# EAGLE design Env_sensor_v1.0 (EAGLE 9.3.0)

## Sheet 1 of 2
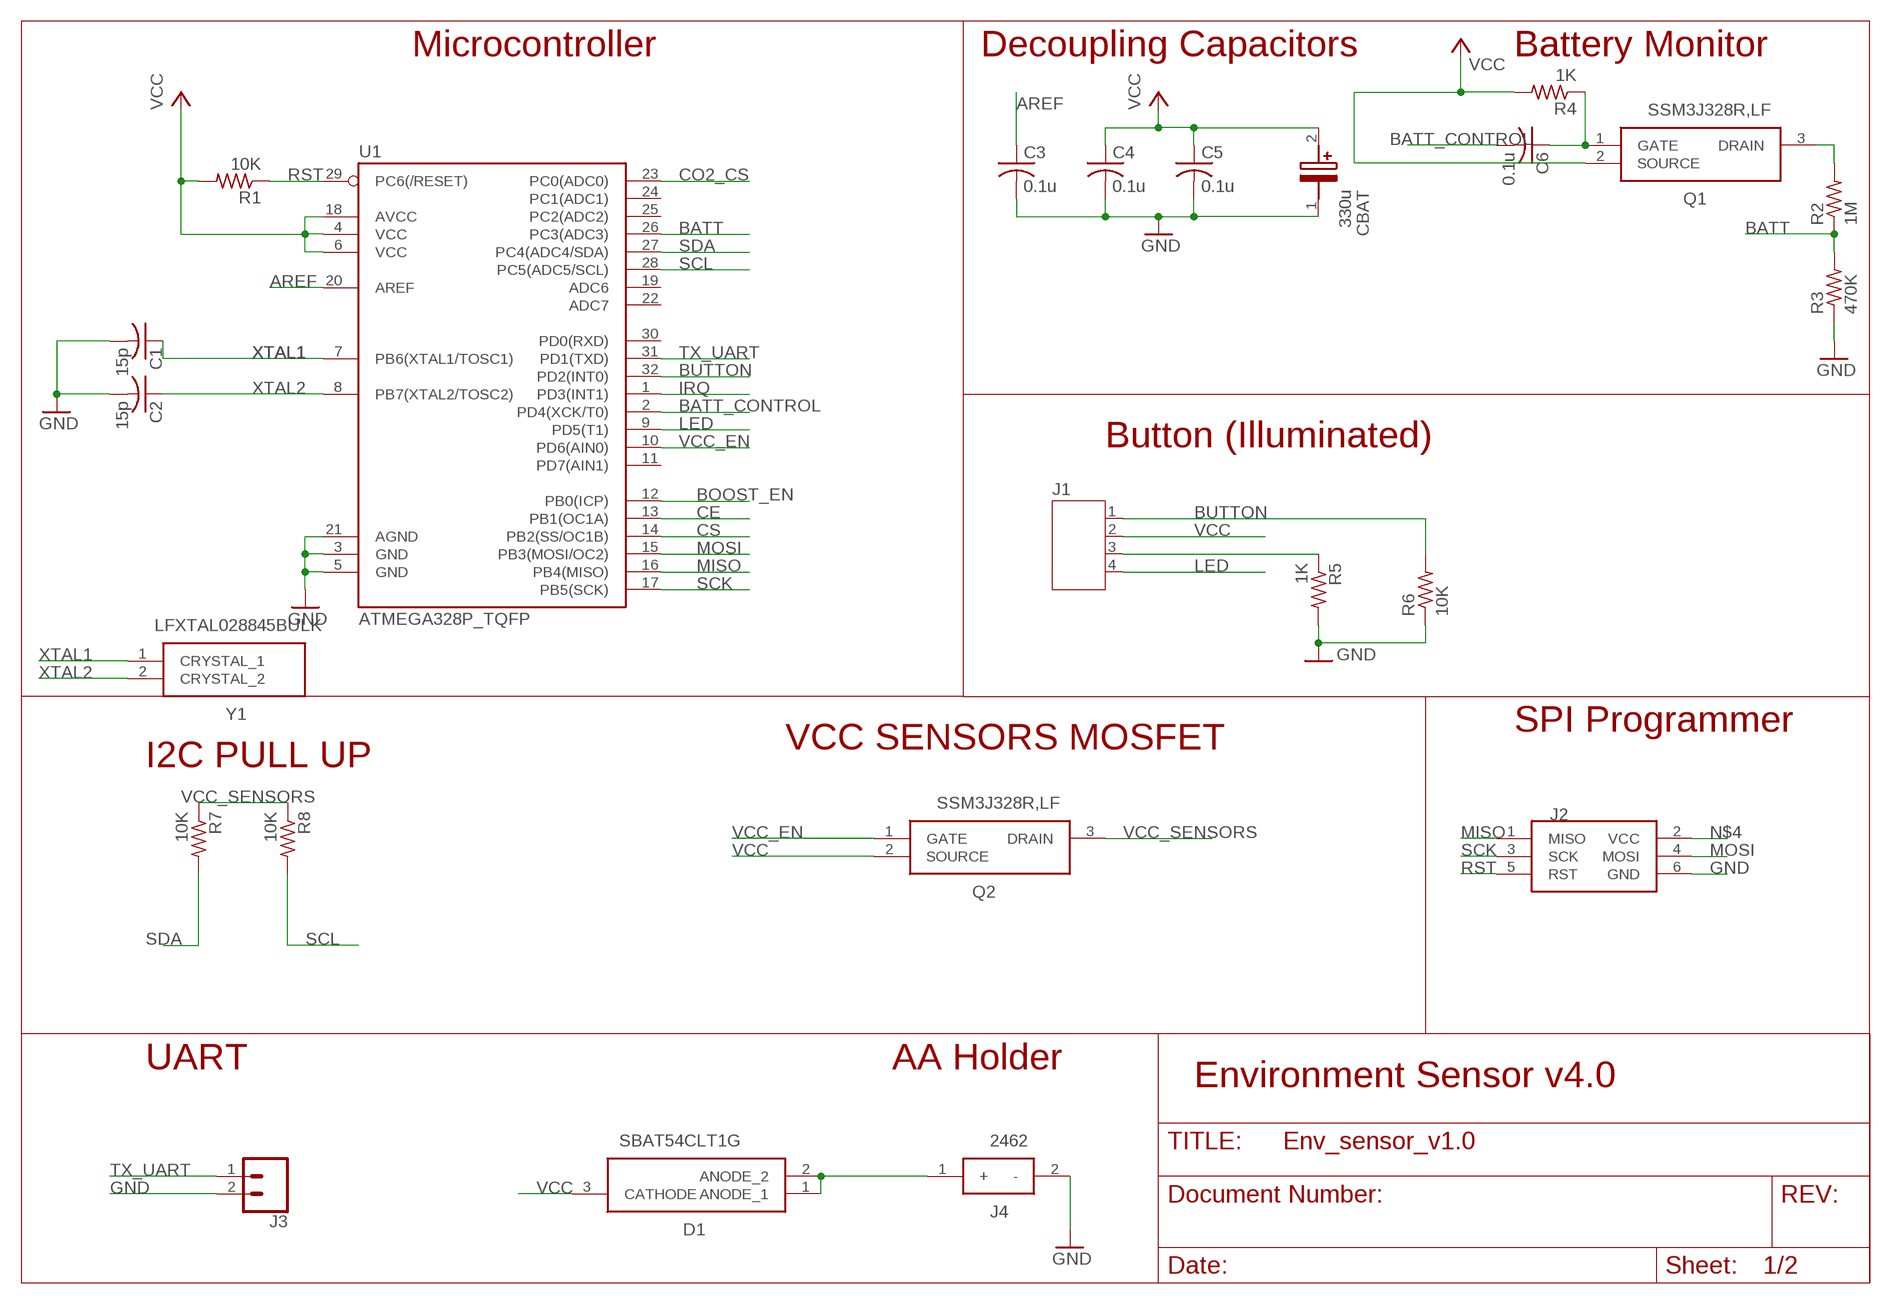
[diagram p0: schematic, sheet 1]

### Parts
C1  15p  CAPACITOR-SMD-0805  [SMD-0805]
C2  15p  CAPACITOR-SMD-0805  [SMD-0805]
C3  0.1u  CAPACITOR-SMD-0805  [SMD-0805]
C4  0.1u  CAPACITOR-SMD-0805  [SMD-0805]
C5  0.1u  CAPACITOR-SMD-0805  [SMD-0805]
C6  0.1u  CAPACITOR-SMD-0805  [SMD-0805]
CBAT  330u  EEE-FNC271XUP  [SMD_LYTIC_D8]
D1  SBAT54CLT1G  [SOT96P237X111-3N]
J1  JST-PH4  [JST-PH4]
J2  ISP  AVRISP-6  [AVRISP]
J3  CONN_02  [1X02]
J4  2462  [2462]
Q1  SSM3J328R,LF  [SOTFL95P240X88-3N]
Q2  SSM3J328R,LF  [SOTFL95P240X88-3N]
R1  10K  RESISTOR-SMD-0805  [SMD-0805]
R2  1M  RESISTOR-SMD-0805  [SMD-0805]
R3  470K  RESISTOR-SMD-0805  [SMD-0805]
R4  1K  RESISTOR-SMD-0805  [SMD-0805]
R5  1K  RESISTOR-SMD-0805  [SMD-0805]
R6  10K  RESISTOR-SMD-0805  [SMD-0805]
R7  10K  RESISTOR-SMD-0805  [SMD-0805]
R8  10K  RESISTOR-SMD-0805  [SMD-0805]
U1  ATMEGA328P_TQFP  [TQFP32-08]
Y1  LFXTAL028845BULK  [LFXTAL028845BULK]

### Nets
AREF: C3.1 U1.20(AREF)
BATT: R2.1 R3.2 U1.26(PC3(ADC3))
BATT_CONTROL: C6.2 U1.2(PD4(XCK/T0))
BOOST_EN: U1.12(PB0(ICP)) ; also sheet 2
BUTTON: J1.1 R6.2 U1.32(PD2(INT0))
CE: U1.13(PB1(OC1A)) ; also sheet 2
CO2_CS: U1.23(PC0(ADC0)) ; also sheet 2
CS: U1.14(PB2(SS/OC1B)) ; also sheet 2
GND: C1.2 C2.2 C3.2 C4.2 C5.2 CBAT.1 J2.6(GND) J3.2 J4.2(-) R3.1 R5.2 R6.1 U1.3(GND) U1.5(GND) U1.21(AGND) ; also sheet 2
IRQ: U1.1(PD3(INT1)) ; also sheet 2
LED: J1.4 U1.9(PD5(T1))
MISO: J2.1(MISO) U1.16(PB4(MISO)) ; also sheet 2
MOSI: J2.4(MOSI) U1.15(PB3(MOSI/OC2)) ; also sheet 2
N$2: Q1.3(DRAIN) R2.2
N$3: D1.1(ANODE_1) D1.2(ANODE_2) J4.1(+)
N$4: J2.2(VCC)
N$7: J1.3 R5.1
N$8: C6.1 Q1.1(GATE) R4.1
RST: J2.5(RST) R1.1 U1.29(PC6(/RESET))
SCK: J2.3(SCK) U1.17(PB5(SCK)) ; also sheet 2
SCL: R8.2 U1.28(PC5(ADC5/SCL)) ; also sheet 2
SDA: R7.2 U1.27(PC4(ADC4/SDA)) ; also sheet 2
TX_UART: J3.1 U1.31(PD1(TXD))
VCC: C4.1 C5.1 CBAT.2 D1.3(CATHODE) J1.2 Q1.2(SOURCE) Q2.2(SOURCE) R1.2 R4.2 U1.4(VCC) U1.6(VCC) U1.18(AVCC) ; also sheet 2
VCC_EN: Q2.1(GATE) U1.10(PD6(AIN0))
VCC_SENSORS: Q2.3(DRAIN) R7.1 R8.1 ; also sheet 2
XTAL1: C1.1 U1.7(PB6(XTAL1/TOSC1)) Y1.1(CRYSTAL_1)
XTAL2: C2.1 U1.8(PB7(XTAL2/TOSC2)) Y1.2(CRYSTAL_2)
Unconnected: U1.11(PD7(AIN1)) U1.19(ADC6) U1.22(ADC7) U1.24(PC1(ADC1)) U1.25(PC2(ADC2)) U1.30(PD0(RXD))

### Notes on the sheet
- Microcontroller | Decoupling Capacitors | Battery Monitor
- Button (Illuminated)
- SPI Programmer
- VCC SENSORS MOSFET
- I2C PULL UP
- UART | AA Holder
- Environment Sensor v4.0

## Sheet 2 of 2
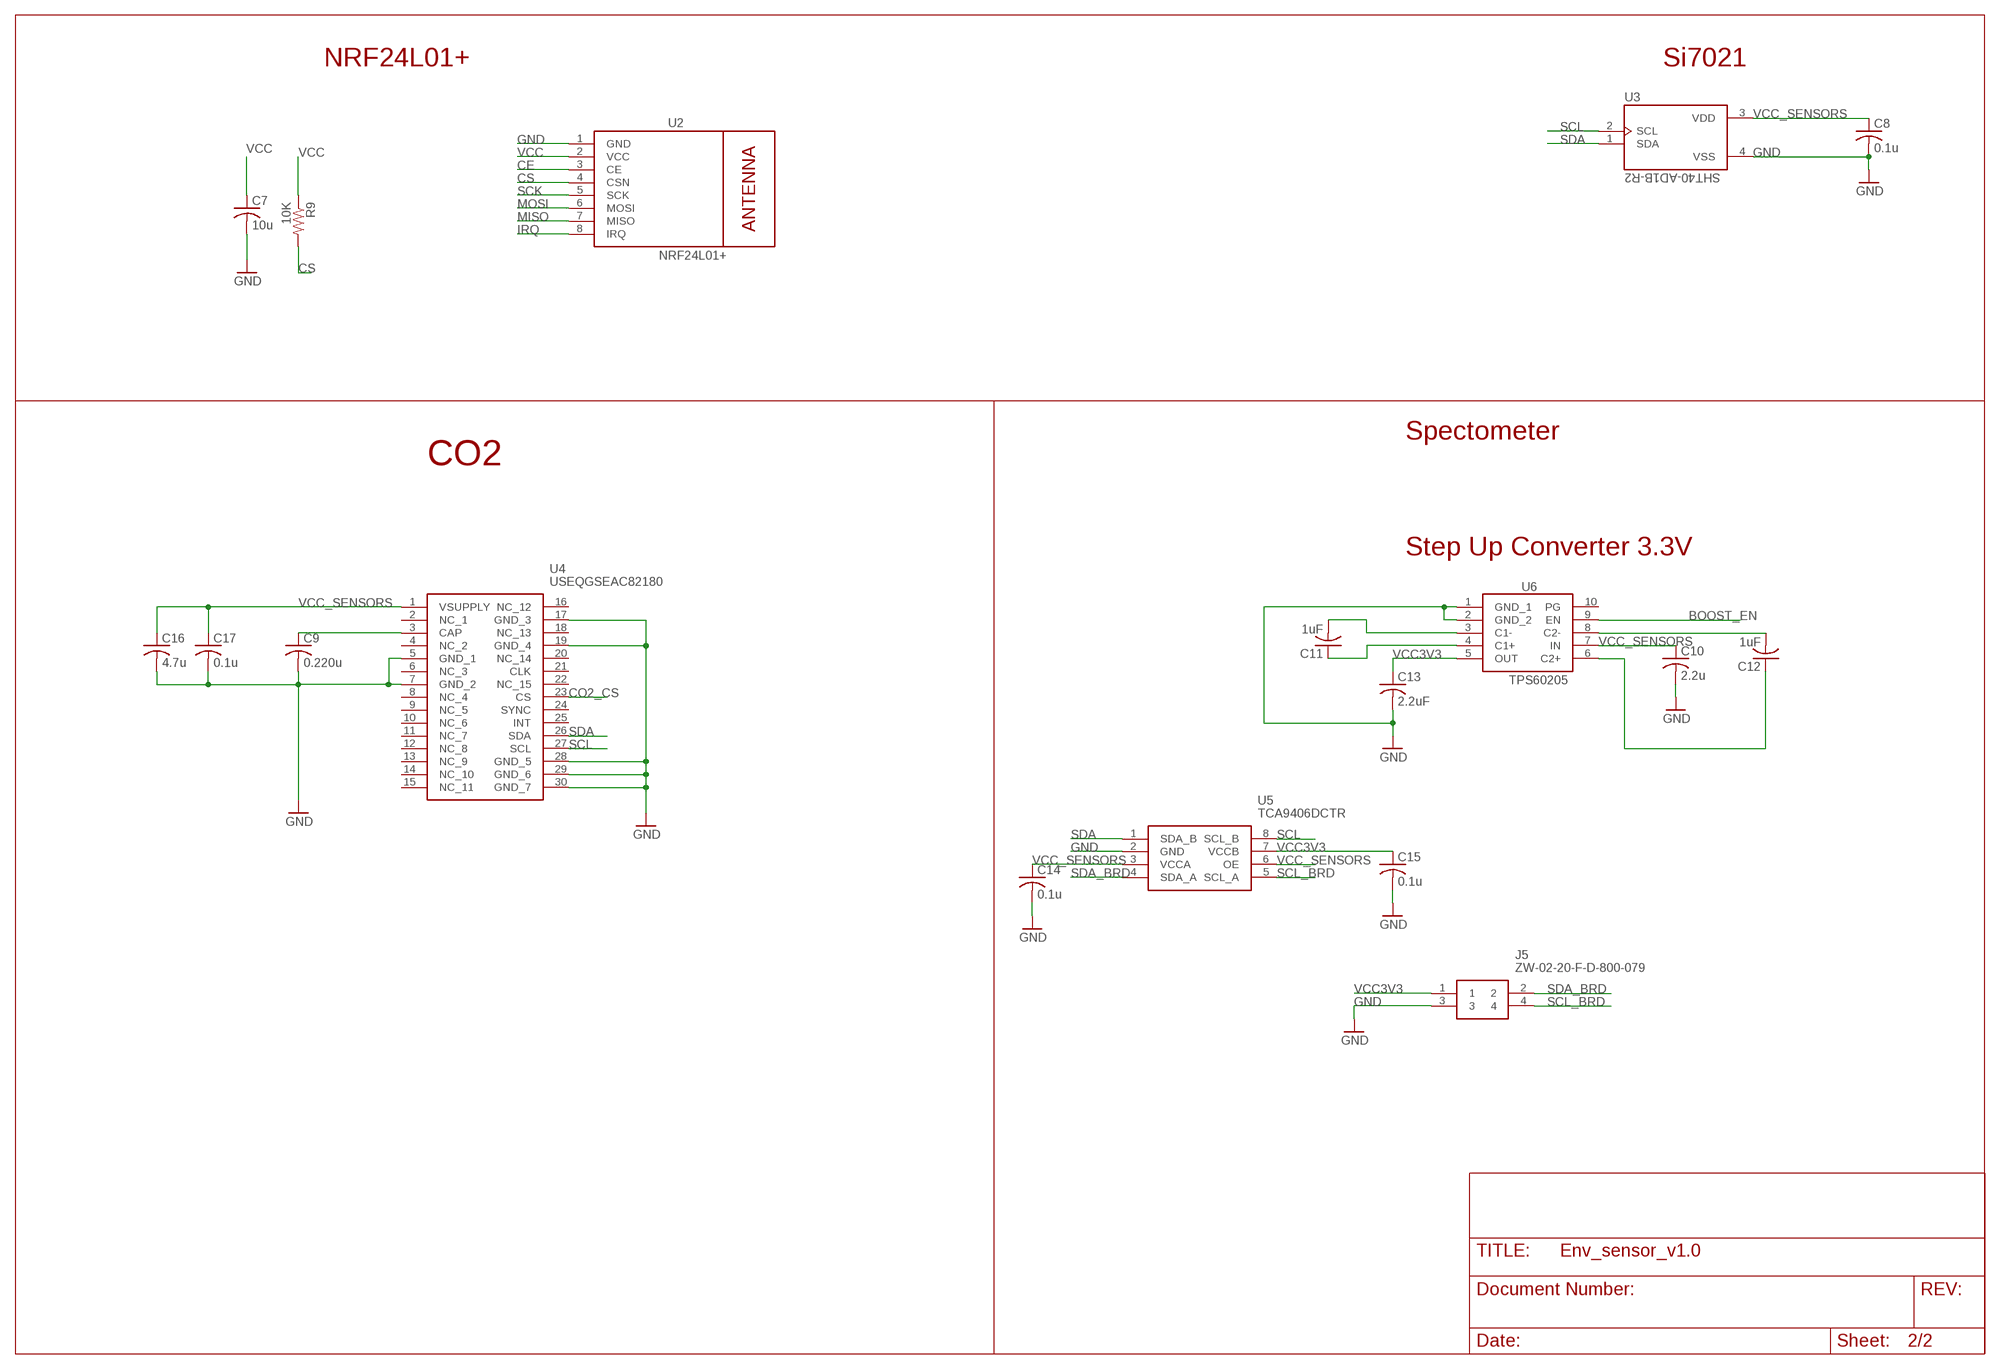
[diagram p1: schematic, sheet 2]

### Parts
C7  10u  CAPACITOR-SMD-0805  [SMD-0805]
C8  0.1u  CAPACITOR-SMD-0805  [SMD-0805]
C9  0.220u  CAPACITOR-SMD-0805  [SMD-0805]
C10  2.2u  CAPACITOR-SMD-0805  [SMD-0805]
C11  1uF  CAPACITOR-SMD-0805  [SMD-0805]
C12  1uF  CAPACITOR-SMD-0805  [SMD-0805]
C13  2.2uF  CAPACITOR-SMD-0805  [SMD-0805]
C14  0.1u  CAPACITOR-SMD-0805  [SMD-0805]
C15  0.1u  CAPACITOR-SMD-0805  [SMD-0805]
C16  4.7u  CAPACITOR-SMD-0805  [SMD-0805]
C17  0.1u  CAPACITOR-SMD-0805  [SMD-0805]
J5  ZW-02-20-F-D-800-079  [HDRV4W64P254_2X2_508X508X2669P]
R9  10K  RESISTOR-SMD-0805  [SMD-0805]
U2  NRF24L01+  WIRELESS-NRF24L01  [WIRELESS-NRF24L01]
U3  SHT40-AD1B-R2  [XDCR_SHT40-AD1B-R2]
U4  USEQGSEAC82180  [USEQGSEAC82180]
U5  TCA9406DCTR  [SOP65P400X130-8N]
U6  TPS60205  TPS60205DGSR  [SOP50P488X107-10N]

### Nets
BOOST_EN: U6.9(EN) ; also sheet 1
CE: U2.3(CE) ; also sheet 1
CO2_CS: U4.23(CS) ; also sheet 1
CS: R9.2 U2.4(CSN) ; also sheet 1
GND: C7.2 C8.2 C9.2 C10.2 C13.2 C14.2 C15.2 C16.2 C17.2 J5.3 U2.1(GND) U3.4(VSS) U4.5(GND_1) U4.7(GND_2) U4.17(GND_3) U4.19(GND_4) U4.28(GND_5) U4.29(GND_6) U4.30(GND_7) U5.2(GND) U6.1(GND_1) U6.2(GND_2) ; also sheet 1
IRQ: U2.8(IRQ) ; also sheet 1
MISO: U2.7(MISO) ; also sheet 1
MOSI: U2.6(MOSI) ; also sheet 1
N$1: C9.1 U4.3(CAP)
N$6: C11.1 U6.4(C1+)
N$9: C11.2 U6.3(C1-)
N$10: C12.1 U6.6(C2+)
N$11: C12.2 U6.8(C2-)
SCK: U2.5(SCK) ; also sheet 1
SCL: U3.2(SCL) U4.27(SCL) U5.8(SCL_B) ; also sheet 1
SCL_BRD: J5.4 U5.5(SCL_A)
SDA: U3.1(SDA) U4.26(SDA) U5.1(SDA_B) ; also sheet 1
SDA_BRD: J5.2 U5.4(SDA_A)
VCC: C7.1 R9.1 U2.2(VCC) ; also sheet 1
VCC3V3: C13.1 C15.1 J5.1 U5.7(VCCB) U6.5(OUT)
VCC_SENSORS: C8.1 C10.1 C14.1 C16.1 C17.1 U3.3(VDD) U4.1(VSUPPLY) U5.3(VCCA) U5.6(OE) U6.7(IN) ; also sheet 1
Unconnected: U4.2(NC_1) U4.4(NC_2) U4.6(NC_3) U4.8(NC_4) U4.9(NC_5) U4.10(NC_6) U4.11(NC_7) U4.12(NC_8) U4.13(NC_9) U4.14(NC_10) U4.15(NC_11) U4.16(NC_12) U4.18(NC_13) U4.20(NC_14) U4.21(CLK) U4.22(NC_15) U4.24(SYNC) U4.25(INT) U6.10(PG)

### Notes on the sheet
- NRF24L01+ | Si7021
- Spectometer
- CO2
- Step Up Converter 3.3V

## Library data of the parts
C1-C17 = Fuzzy:CAPACITOR-SMD-0805
CBAT = SamacSys_Parts:EEE-FNC271XUP: PANASONIC - EEE-FNC271XUP - CAP, 270UF, 16V, ALU ELEC, SMD Source: Datasheet <http://industrial.panasonic.com/cdbs/www-data/pdf/RDE0000/RDE0000C1259.pdf>; DESCRIPTION: PANASONIC - EEE-FNC271XUP - CAP, 270UF, 16V, ALU ELEC, SMD; HEIGHT: 7.8mm; MANUFACTURER_NAME: Panasonic; MANUFACTURER_PART_NUMBER: EEE-FNC271XUP; MOUSER_PART_NUMBER: 667-EEE-FNC271XUP; MOUSER_PRICE-STOCK: https://www.mouser.co.uk/ProductDetail/Panasonic/EEE-FNC271XUP?qs=OlC7AqGiEDk4Wtbs6TVCqQ%3D%3D
D1 = SamacSys_Parts:SBAT54CLT1G: ON SEMICONDUCTOR - SBAT54CLT1G - DIODE, SCHOTTKY, AEC-Q101, 30V, SOT-23 Source: Datasheet <http://www.onsemi.com/pub/Collateral/BAT54CLT1-D.PDF>; DESCRIPTION: ON SEMICONDUCTOR - SBAT54CLT1G - DIODE, SCHOTTKY, AEC-Q101, 30V, SOT-23; HEIGHT: 1.11mm; MANUFACTURER_NAME: ON Semiconductor; MANUFACTURER_PART_NUMBER: SBAT54CLT1G; MOUSER_PART_NUMBER: 863-SBAT54CLT1G; MOUSER_PRICE-STOCK: https://www.mouser.co.uk/ProductDetail/ON-Semiconductor/SBAT54CLT1G?qs=3PKVEWFFm28iDw9tuZM%2FZA%3D%3D
J1 = jst-ph:JST-PH4
J2 = adafruit:AVRISP: AVR ISP HEADER Standard 6 pin header for AVR programming
J3 = SparkFun-Connectors:CONN_02: Multi connection point. Often used as Generic Header-pin footprint for 0.1 inch spaced/style header connections On any of the 0.1 inch spaced packages, you can populate with these: Break Away Headers - Straight <https://www.sparkfun.com/products/116> (PRT-00116) Break Away Male Headers - Right Angle <https://www.sparkfun.com/products/553> (PRT-00553) Female Headers <https://www.sparkfun.com/products/115> (PRT-00115) Break Away Headers - Machine Pin <https://www.sparkfun.com/products/117> (PRT-00117) Break Away Female Headers - Swiss Machine Pin <https://www.sparkfun.com/products/743> (PRT-00743) For SCREWTERMINALS and SPRING TERMINALS visit here: Screw Terimnals on SparkFun.com <https://www.sparkfun.com/search/results?term=Screw+Terminals> (5mm/3.5mm/2.54mm spacing) This device is also useful as a general connection point to wire up your design to another part of your project. Our various solder wires solder well into these plated through hole pads. Hook-Up Wire - Assortment (Stranded, 22 AWG) <https://www.sparkfun.com/products/11375> (PRT-11375) Hook-Up Wire - Assortment (Solid Core, 22 AWG) <https://www.sparkfun.com/products/11367> (PRT-11367) View the entire wire category on our website here <https://www.sparkfun.com/categories/141> Special notes: Molex polarized connector foot print use with: PRT-08233 with associated crimp pins and housings. 2.54_SCREWTERM for use with PRT-10571. 3.5mm Screw Terminal footprints for PRT-08084 5mm Screw Terminal footprints for use with PRT-08432
J4 = SamacSys_Parts:2462: KEYSTONE - 2462 - BATTERY HOLDER Source: Datasheet <https://componentsearchengine.com/Datasheets/1/2462.pdf>; DESCRIPTION: KEYSTONE - 2462 - BATTERY HOLDER; HEIGHT: mm; MANUFACTURER_NAME: Keystone Electronics; MANUFACTURER_PART_NUMBER: 2462; MOUSER_PART_NUMBER: 534-2462
J5 = SamacSys_Parts:ZW-02-20-F-D-800-079: .100" Flex Stack, Flexible Board Stacker, Custom Tail, positions, row Source: Datasheet <https://componentsearchengine.com/Datasheets/1/ZW-02-20-F-D-800-079.pdf>; DESCRIPTION: .100" Flex Stack, Flexible Board Stacker, Custom Tail, positions, row; HEIGHT: 26.693mm; MANUFACTURER_NAME: SAMTEC; MANUFACTURER_PART_NUMBER: ZW-02-20-F-D-800-079; MOUSER_PART_NUMBER: 200-ZW0220FD800079; MOUSER_PRICE-STOCK: https://www.mouser.com/Search/Refine.aspx?Keyword=200-ZW0220FD800079
Q1 Q2 = SamacSys_Parts:SSM3J328R,LF: MOSFET P-Ch Sm Sig FET Id -6A -20V -8VGSS Source: Datasheet <https://componentsearchengine.com/Datasheets/1/SSM3J328R,LF.pdf>; DESCRIPTION: MOSFET P-Ch Sm Sig FET Id -6A -20V -8VGSS; HEIGHT: 0.88mm; MANUFACTURER_NAME: Toshiba; MANUFACTURER_PART_NUMBER: SSM3J328R,LF; MOUSER_PART_NUMBER: 757-SSM3J328RLF
R1-R9 = Fuzzy:RESISTOR-SMD-0805
U1 = SparkFun-IC-Microcontroller:ATMEGA328P_TQFP: Popular 328P in QFP Storefront component: ATmega328 - TQFP <https://www.sparkfun.com/products/13448> (COM-13448) Datasheet <http://www.sparkfun.com/datasheets/Components/SMD/ATMega328.pdf> SparkFun Products SparkFun RedBoard - Programmed with Arduino <https://www.sparkfun.com/products/12757> (DEV-12757) Arduino Pro Mini 328 - 5V/16MHz <https://www.sparkfun.com/products/11113> (DEV-11113) Arduino Pro Mini 328 - 3.3V/8MHz <https://www.sparkfun.com/products/11114> (DEV-11114) SparkFun OpenLog <https://www.sparkfun.com/products/13712> (DEV-13712) SparkFun MicroView - OLED Arduino Module <https://www.sparkfun.com/products/12923> (DEV-12923) SparkFun Digital Sandbox <https://www.sparkfun.com/products/12651> (DEV-12651) SparkFun PicoBoard <https://www.sparkfun.com/products/11888> (WIG-11888) Arduino Fio <https://www.sparkfun.com/products/10116> (DEV-10116) LilyPad Arduino 328 Main Board <https://www.sparkfun.com/products/13342> (DEV-13342) SparkFun RedStick <https://www.sparkfun.com/products/13741> (DEV-13741) LilyPad MP3 <https://www.sparkfun.com/products/11013> (DEV-11013) LilyPad Arduino SimpleSnap <https://www.sparkfun.com/products/10941> (DEV-10941) SparkFun Stepoko <https://www.sparkfun.com/products/13899> (ROB-13899) SparkFun Geiger Counter <https://www.sparkfun.com/products/11345> (SEN-11345) SparkFun EL Sequencer <https://www.sparkfun.com/products/12781> (COM-12781) Arduino Pro 328 - 5V/16MHz <https://www.sparkfun.com/products/10915> (DEV-10915) CryptoCape <https://www.sparkfun.com/products/12773> (DEV-12773) SparkFun IR Thermometer Evaluation Board - MLX90614 <https://www.sparkfun.com/products/10740> (SEN-10740) SparkFun RedBot Mainboard <https://www.sparkfun.com/products/12097> (ROB-12097) Arduino Pro 328 - 3.3V/8MHz <https://www.sparkfun.com/products/10914> (DEV-10914) SparkFun Block for Intel® Edison - Arduino <https://www.sparkfun.com/products/13036> (DEV-13036) SparkFun Simon Says - Surface Mount Soldering Kit <https://www.sparkfun.com/products/10935> (KIT-10935) SparkFun 7-Segment Serial Display - Red <https://www.sparkfun.com/products/11441> (COM-11441) SparkFun 7-Segment Serial Display - White <https://www.sparkfun.com/products/11629> (COM-11629) SparkFun 7-Segment Serial Display - Yellow <https://www.sparkfun.com/products/11443> (COM-11443) SparkFun 7-Segment Serial Display - Kelly Green <https://www.sparkfun.com/products/11440> (COM-11440) SparkFun 7-Segment Serial Display - Blue <https://www.sparkfun.com/products/11442> (COM-11442) SparkFun OpenSegment Serial Display - 20mm (Blue) <https://www.sparkfun.com/products/11647> (COM-11647) SparkFun OpenSegment Serial Display - 20mm (Green) <https://www.sparkfun.com/products/11646> (COM-11646) SparkFun OpenSegment Serial Display - 20mm (White) <https://www.sparkfun.com/products/11648> (COM-11648) SparkFun OpenSegment Serial Display - 20mm (Red) <https://www.sparkfun.com/products/11644> (COM-11644) SparkFun OpenSegment Serial Display - 20mm (Yellow) <https://www.sparkfun.com/products/11645> (COM-11645) SparkFun OpenSegment Shield <https://www.sparkfun.com/products/13190> (DEV-13190); PROD_ID: IC-09069
U2 = diy-modules:WIRELESS-NRF24L01: 2.4 GHz Wireless Module based on NRF24L01 chip More details available here: http://www.electrodragon.com/w/NRF24L01 Click here to find device on ebay.com <http://www.ebay.com/sch/nrf24l01+arduino>
U3 = SHT40-AD1B-R2:SHT40-AD1B-R2: Check availability <https://pricing.snapeda.com/parts/SHT40-AD1B-R2/Sensirion/view-part?ref=eda>; AVAILABILITY: In Stock; DESCRIPTION: HUMIDITY AND TEMPERATURE SENSOR; MF: Sensirion; MP: SHT40-AD1B-R2; PACKAGE: WDFN-4 Sensirion; PRICE: None; PURCHASE-URL: https://pricing.snapeda.com/search/part/SHT40-AD1B-R2/?ref=eda
U4 = SamacSys_Parts:USEQGSEAC82180: Gas detector, Digital SMD, Gas CO2 Source: Datasheet; DESCRIPTION: Gas detector, Digital SMD, Gas CO2; HEIGHT: 1.55mm; MANUFACTURER_NAME: Kemet; MANUFACTURER_PART_NUMBER: USEQGSEAC82180; MOUSER_PART_NUMBER: 80-USEQGSEAC82180; MOUSER_PRICE-STOCK: https://www.mouser.co.uk/ProductDetail/KEMET/USEQGSEAC82180?qs=xZ%2FP%252Ba9zWqazFVwLF081YA%3D%3D
U5 = SamacSys_Parts:TCA9406DCTR: 2-Bit Bidirectional 1-MHz I2C Bus and SMBus Voltage-Level Shifter Source: Datasheet <http://www.ti.com/lit/ds/symlink/tca9406.pdf>; DESCRIPTION: 2-Bit Bidirectional 1-MHz I2C Bus and SMBus Voltage-Level Shifter; HEIGHT: 1.3mm; MANUFACTURER_NAME: Texas Instruments; MANUFACTURER_PART_NUMBER: TCA9406DCTR; MOUSER_PART_NUMBER: 595-TCA9406DCTR; MOUSER_PRICE-STOCK: https://www.mouser.co.uk/ProductDetail/Texas-Instruments/TCA9406DCTR/?qs=Ze4%2FuFuz19L6Yntu0RTUyw%3D%3D
U6 = SamacSys_Parts:TPS60205DGSR: Regulated 3.3-V Low Ripple Charge Pump with Power Good Indicator Source: Datasheet <http://www.ti.com/lit/gpn/tps60205>; DESCRIPTION: Regulated 3.3-V Low Ripple Charge Pump with Power Good Indicator; HEIGHT: 1.07mm; MANUFACTURER_NAME: Texas Instruments; MANUFACTURER_PART_NUMBER: TPS60205DGSR; MOUSER_PART_NUMBER: 595-TPS60205DGSR; MOUSER_PRICE-STOCK: https://www.mouser.co.uk/ProductDetail/Texas-Instruments/TPS60205DGSR/?qs=Gse6rAGbi7%2FRk8JPPwrTXw%3D%3D
Y1 = SamacSys_Parts:LFXTAL028845BULK: Crystals 4MHz 12pF -20C 70C Source: Datasheet; DESCRIPTION: Crystals 4MHz 12pF -20C 70C; HEIGHT: 4.3mm; MANUFACTURER_NAME: IQD; MANUFACTURER_PART_NUMBER: LFXTAL028845BULK

## Net classes
0 default: width 0.254 mm, drill 0.508 mm, clearance 0.203 mm

## Board
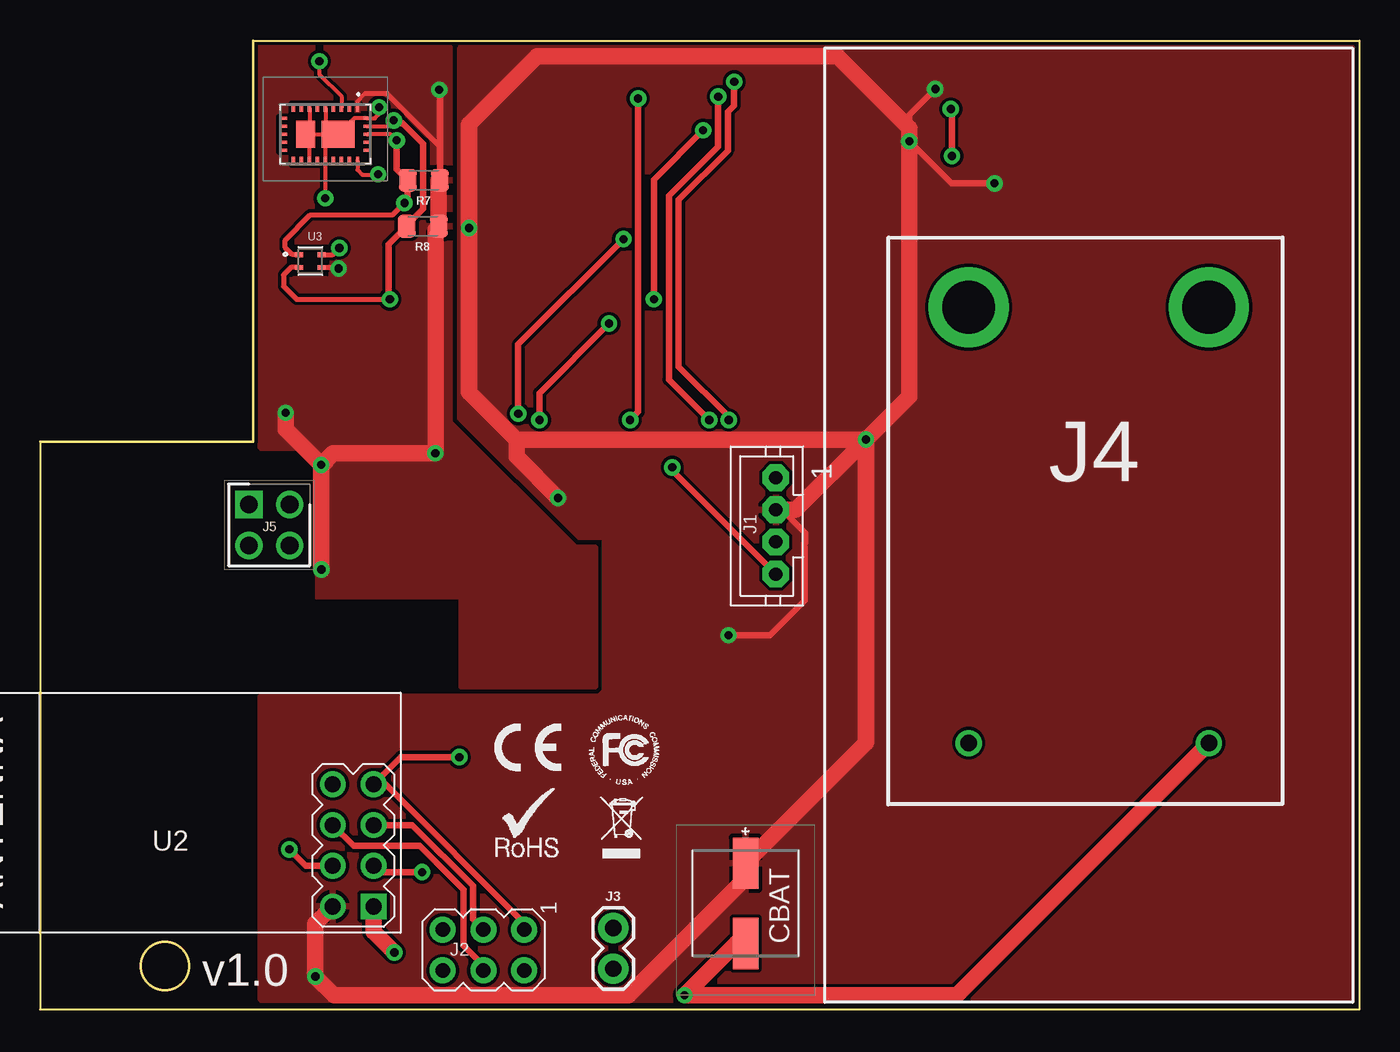
[diagram p2: board, top side]
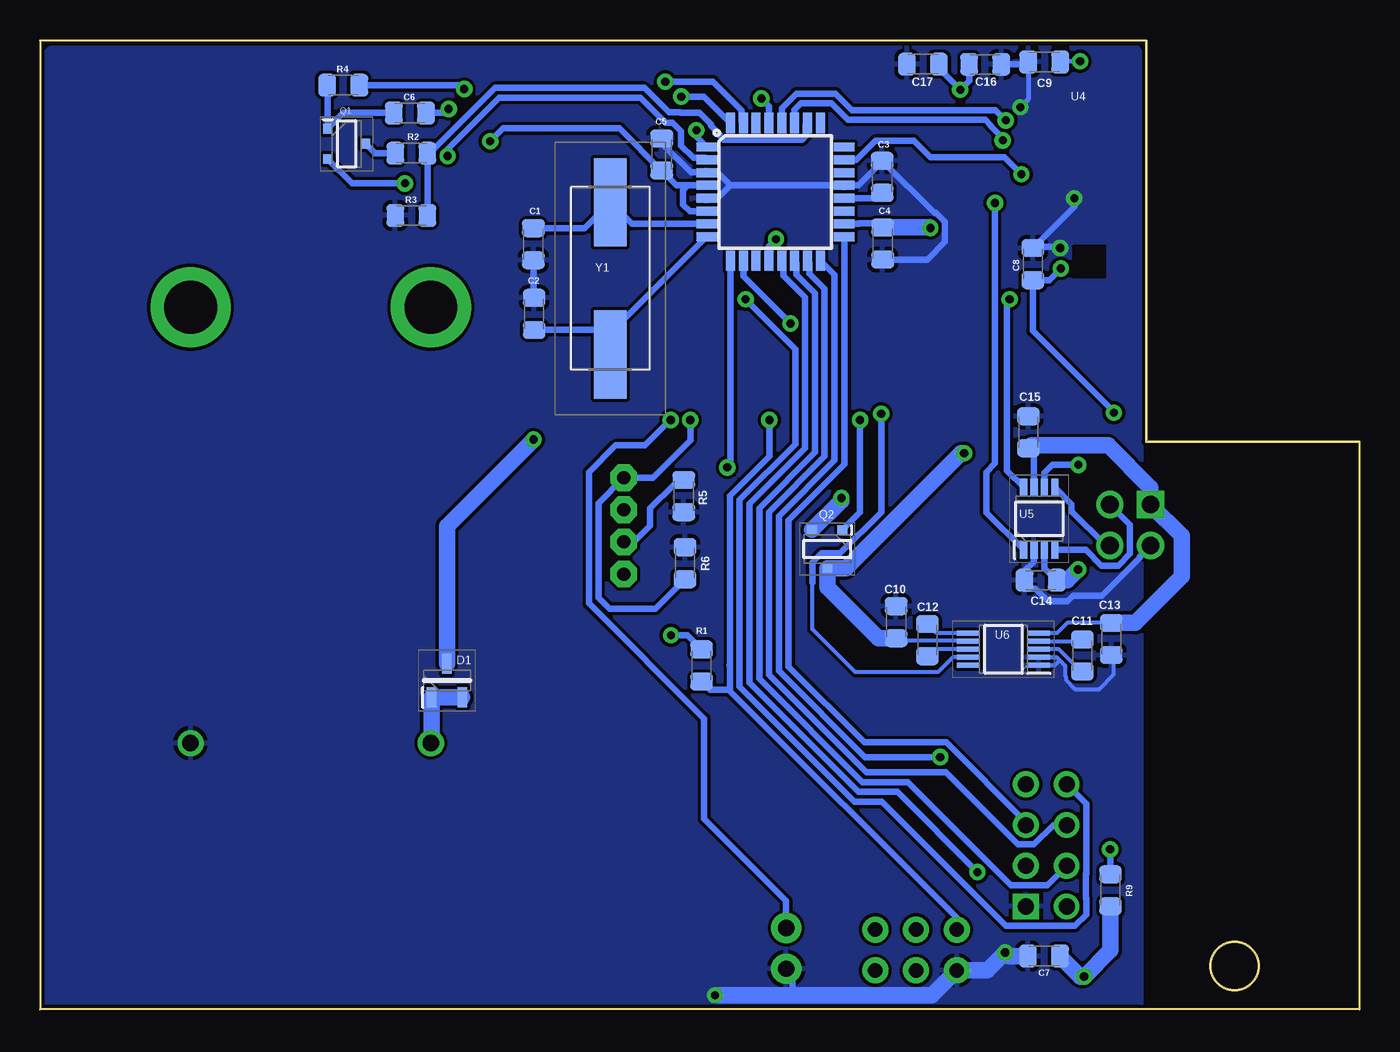
[diagram p3: board, bottom side, seen from below]

Size 82.3 x 60.4 mm. Coordinates in mm from the lower left corner, seen from the top.
Outline: 82.3,60.4 82.3,0 0,0 0,35.4 13.3,35.4 13.3,60.4 82.3,60.4
Outline: circle at 7.8,2.7 radius 1.5
Copper layers (1*16): Top 0.035mm / dielectric 1.5mm / Bottom 0.035mm
Design rules "SparkFun *": minimum track width 6mil, minimum drill 20mil, track to track 1mil, track to pad 1mil, pad to pad 1mil, via to via 1mil, smd to smd 1mil, copper to edge 8mil, drill to drill 8mil, minimum pad ring 12mil, minimum via ring 10mil, stop-mask expansion 4mil, vias tented up to drill 20mil, thermal gap 10mil

### Footprints (pad centres in the part's own frame; a part is rotated, then mirrored left to right if it is on the bottom)
SMD-0805 = smd 1.1 x 1.4: 1 -1,0; 2 1,0
SMD_LYTIC_D8 = smd 3.2 x 1.6: 1 -2.5,0; 2 2.5,0
SOT96P237X111-3N = smd 1.25 x 0.6: 1 -1.05,0.955; 2 -1.05,-0.955; 3 1.05,0
JST-PH4 = drill 0.813 pad 1.676 octagon: 1 3,0; 2 1,0; 3 -1,0; 4 -3,0
AVRISP = drill 0.9 pad 1.626: 1 -1.27,2.54; 2 1.27,2.54; 3 -1.27,0; 4 1.27,0; 5 -1.27,-2.54; 6 1.27,-2.54
1X02 = drill 1.016 pad 1.88: 1 0,0; 2 2.54,0
2462 = drill 1.02 pad 1.6: 1 13.59,-7.495; 2 13.59,7.495 | drill 3.3 pad 5: 3 -13.59,7.495; 4 -13.59,-7.495
HDRV4W64P254_2X2_508X508X2669P = drill 1.1 pad 1.65 square: 1 -1.27,-1.27 | drill 1.1 pad 1.65: 2 -1.27,1.27; 3 1.27,-1.27; 4 1.27,1.27
SOTFL95P240X88-3N = smd 0.575 x 0.62: 1 -1.188,0.95; 2 -1.188,-0.95; 3 1.188,0
TQFP32-08 = smd 1.27 x 0.559: 1 -4.293,2.8; 2 -4.293,2; 3 -4.293,1.2; 4 -4.293,0.4; 5 -4.293,-0.4; 6 -4.293,-1.2; 7 -4.293,-2; 8 -4.293,-2.8; 17 4.293,-2.8; 18 4.293,-2; 19 4.293,-1.2; 20 4.293,-0.4; 21 4.293,0.4; 22 4.293,1.2; 23 4.293,2; 24 4.293,2.8 | smd 0.559 x 1.27: 9 -2.8,-4.293; 10 -2,-4.293; 11 -1.2,-4.293; 12 -0.4,-4.293; 13 0.4,-4.293; 14 1.2,-4.293; 15 2,-4.293; 16 2.8,-4.293; 25 2.8,4.293; 26 2,4.293; 27 1.2,4.293; 28 0.4,4.293; 29 -0.4,4.293; 30 -1.2,4.293; 31 -2,4.293; 32 -2.8,4.293
WIRELESS-NRF24L01 = drill 1 square: 1 -12.7,6.35 | drill 1: 2 -10.16,6.35; 3 -12.7,3.81; 4 -10.16,3.81; 5 -12.7,1.27; 6 -10.16,1.27; 7 -12.7,-1.27; 8 -10.16,-1.27
XDCR_SHT40-AD1B-R2 = smd 0.5 x 0.3: 1 -0.7,0.4; 2 -0.7,-0.4; 3 0.7,-0.4; 4 0.7,0.4
USEQGSEAC82180 = smd 0.2 x 0.5: 1 -2,-1.645; 2 -1.5,-1.645; 3 -1,-1.645; 4 -0.5,-1.645; 5 0,-1.645; 6 0.5,-1.645; 7 1,-1.645; 8 1.5,-1.645; 9 2,-1.645; 15 2,1.645; 16 1.5,1.645; 17 1,1.645; 18 0.5,1.645; 19 0,1.645; 20 -0.5,1.645; 21 -1,1.645; 22 -1.5,1.645; 23 -2,1.645 | smd 0.5 x 0.2: 10 2.625,-1; 11 2.625,-0.5; 12 2.625,0; 13 2.625,0.5; 14 2.625,1; 24 -2.625,1; 25 -2.625,0.5; 26 -2.625,0; 27 -2.625,-0.5; 28 -2.625,-1 | smd 2.05 x 1.69: 29 -0.8,0 | smd 1.19 x 1.69: 30 1.23,0
SOP65P400X130-8N = smd 1.1 x 0.45: 1 -1.95,0.975; 2 -1.95,0.325; 3 -1.95,-0.325; 4 -1.95,-0.975; 5 1.95,-0.975; 6 1.95,-0.325; 7 1.95,0.325; 8 1.95,0.975
SOP50P488X107-10N = smd 1.4 x 0.3: 1 -2.2,1; 2 -2.2,0.5; 3 -2.2,0; 4 -2.2,-0.5; 5 -2.2,-1; 6 2.2,-1; 7 2.2,-0.5; 8 2.2,0; 9 2.2,0.5; 10 2.2,1
LFXTAL028845BULK = smd 5.5 x 2: 1 -4.75,0; 2 4.75,0

### Placement (x,y rotation side)
C1  51.53,47.71 270 bottom
C2  51.48,43.36 90 bottom
C3  29.77,51.91 90 bottom
C4  29.74,47.75 270 bottom
C5  43.52,53.3 90 bottom
C6  59.23,55.89 0 bottom
C7  19.68,3.32 180 bottom
C8  20.37,46.47 90 bottom
C9  19.66,59.07 180 bottom
C10  28.9,24.14 90 bottom
C11  17.28,22.06 270 bottom
C12  26.95,23.02 270 bottom
C13  15.48,23.09 270 bottom
C14  19.89,26.76 180 bottom
C15  20.65,35.98 90 bottom
C16  23.34,58.92 0 bottom
C17  27.23,58.94 180 bottom
CBAT  44.01,6.61 90 top
D1  56.92,20.5 90 bottom
J1  45.89,30.14 90 top
J2  27.66,3.7 270 top
J3  35.76,5.07 270 top
J4  65.42,30.19 270 top
J5  14.3,30.2 270 top
Q1  63.18,53.97 0 bottom
Q2  33.19,28.7 270 bottom
R1  41.03,21.44 90 bottom
R2  59.14,53.39 180 bottom
R3  59.14,49.5 0 bottom
R4  63.39,57.63 0 bottom
R5  42.15,32 270 bottom
R6  42.07,27.82 270 bottom
R7  23.94,51.69 180 top
R8  23.87,48.83 180 top
R9  15.53,7.42 90 bottom
U1  36.43,50.97 0 bottom
U2  8.1,12.76 180 top
U3  16.85,46.66 0 top
U4  17.8,54.56 180 top
U5  19.97,30.59 90 bottom
U6  22.2,22.45 180 bottom
Y1  46.73,45.58 270 bottom

### Tracks (layer width: path | path; a pad name or v marks a point on that pad's centre or on a via)
AREF
  Bottom 0.406: C3.1 30.11,50.57 U1.20
BATT
  Bottom 0.406: R3.2 58.14,53.24 | 58.14,53.24 R2.1 | U1.26 34.54,55.15 34.54,54.46 34.78,54.22 39.68,54.22 39.92,54.46 39.92,54.56 40.45,55.09 40.45,55.19 41.16,55.9 42.35,55.9 42.39,55.94 43.08,55.94 44.6,57.46 53.92,57.46 58.14,53.24
BATT_CONTROL  (via drill 0.51)
  Top 0.406: v56.88,53.21 56.88,56.07 v56.81,56.14
  Bottom 0.406: U1.2 40.84,53.08 41.53,53.08 42.3,53.86 42.3,54.34 42.3,54.75 42.85,55.29 43.29,55.29 44.85,56.85 53.67,56.85 56.88,53.64 v56.88,53.21 | v56.81,56.14 57.06,55.89 C6.2
BOOST_EN  (via drill 0.51)
  Top 0.406: v36.39,48.02 29.83,41.46 v29.83,37.14
  Bottom 0.254: U6.9 25.37,21.95 26.3,21.02 31.45,21.02 34.13,23.7 34.13,26.61
  Bottom 0.406: U1.12 36.83,47.59 v36.39,48.02 | v29.83,37.14 29.83,31 32.4,28.43 33.57,28.43 34.13,27.86 34.13,26.61
BUTTON  (via drill 0.51)
  Top 0.406: v42.3,56.91 42.3,53.79 39.23,50.72 39.23,39.26 v41.74,36.75
  Bottom 0.406: U1.32 40.88,56.91 v42.3,56.91 | R6.2 43.9,24.99 46.79,24.99 47.46,25.66 47.46,31.57 J1.1 44.08,33.14 41.74,35.48 v41.74,36.75
CE  (via drill 0.51)
  Top 0.406: v23.84,8.55 21.2,8.55 U2.3
  Bottom 0.406: U1.13 35.92,46.56 35.92,45.75 34.58,44.41 34.58,34.98 38.05,31.51 38.05,20.35 31.25,13.55 28.83,13.55 v23.84,8.55
CO2_CS  (via drill 0.51)
  Top 0.254: U4.23 19.8,52.34 20.1,52.04 21.06,52.04 v21.09,52.07
  Bottom 0.406: v21.09,52.07 22.16,53.14 26.77,53.14 27.8,54.17 30.19,54.17 31.39,52.97 U1.23
CS  (via drill 0.51)
  Top 0.406: U2.4 16.57,8.95 v15.55,9.97
  Bottom 0.406: U1.14 35.12,46.56 35.12,45.81 33.97,44.66 33.97,34.73 37.44,31.26 37.44,20.6 31,14.16 28.15,14.16 21.73,7.74 20.3,7.74 19.47,7.74 U2.4 | v15.55,9.97 15.55,8.44 R9.2
GND  (via drill 0.51)
  Top 0.254: U4.5 17.8,54.6 17.76,54.56 U4.30 | U4.7 16.8,54.79 | U4.17 16.8,54.55 | v21.15,56.24 21.15,55.83 20.88,55.56 U4.28 19.6,55.56 U4.29 17.8,53.76 U4.19 v17.79,50.57
  Top 0.305: 21.15,56.28 v21.15,56.24 | U3.4 18.26,47.06 v18.67,47.47
  Top 0.406: U4.29 17.84,54.56 17.8,54.6 | 16.8,54.55 16.79,54.56 U4.30 16.8,54.79
  Top 1.016: v22.1,3.54 20.8,4.84 U2.1 | J4.2 57.18,0.87 v40.2,0.87 43.44,4.11 CBAT.1
  Bottom 0.254: U6.2 18.89,21.95 18.69,21.76 | 18.69,21.76 18.36,21.42 18.36,20.78 18.31,20.73 18.31,20.53 17.75,19.97 16.23,19.97 15.32,20.88 15.32,21.93 C13.2 | U6.1 19,21.45 18.69,21.76 | 20.37,47.55 C8.2
  Bottom 0.305: C9.2 20.66,56.73 v21.15,56.24
  Bottom 0.406: C5.2 43.52,54.01 41.7,52.19 40.74,52.19 U1.3 40.61,52.06 39.92,52.06 39.23,51.37 | C2.2 51.53,44.41 C1.2 | 39.23,51.37 U1.21 31.26,51.37 29.77,52.86 C3.2 26.52,49.66 26.41,49.66 25.85,49.1 25.85,47.85 26.95,46.75 C4.2 | U5.2 20.31,28.62 20.31,27.92 20.89,27.34 C14.2 20.89,26.23 20.2,26.23 19.41,25.43 | U1.5 40.03,50.57 39.23,51.37 | J5.3 13.7,28.26 13.7,28.16 16.08,25.78 17.88,25.78 18.22,25.43 19.41,25.43 | 19.39,25.41 19.41,25.43 | J3.2 35.36,2.13 35.36,0.87 | C16.2 20.81,58.92 C9.2 | v18.67,47.47 18.75,47.55 20.37,47.55 | C8.2 17.79,50.05 v17.79,50.57
  Bottom 1.016: C7.2 21.88,3.32 v22.1,3.54 23.21,2.43 J2.6 26.68,0.87 35.36,0.87 v40.2,0.87
  pour Bottom: 13.98,59.94 81.66,59.94 81.9,59.7 81.9,0.54 81.97,0.47 13.67,0.47 13.59,0.39 13.59,59.69 13.89,59.99
IRQ  (via drill 0.51)
  Top 0.406: v41.36,54.81 38.29,51.74 v38.29,44.27
  Bottom 0.406: U1.1 41.36,54.41 v41.36,54.81 | v38.29,44.27 35.18,41.17 35.18,35.23 38.66,31.76 38.66,20.1 31.5,12.94 29.79,12.94 22.05,5.2 17.76,5.2 17.05,5.91 17.05,6.91 17.06,6.92 17.06,8.44 17.05,8.45 17.05,12.82 U2.8
LED  (via drill 0.51)
  Top 0.406: v39.44,33.79 39.44,33.59 J1.4
  Bottom 0.406: U1.9 39.23,34 v39.44,33.79
MISO  (via drill 0.51)
  Top 0.406: v26.15,15.73 22.5,15.73 U2.7 21.54,14.03 30.2,5.37 J2.1
  Bottom 0.406: U1.16 32.75,45.79 32.75,34.23 36.22,30.75 36.22,21.11 30.84,15.73 v26.15,15.73
MOSI
  Top 0.406: U2.6 19.56,10.19 23.66,10.19 26.41,7.44 26.41,3.96 27.66,2.71 J2.4
  Bottom 0.406: U1.15 34.32,46.56 34.32,45.87 33.36,44.91 33.36,34.48 36.83,31 36.83,20.86 30.74,14.77 25.79,14.77 21.3,10.28 20.3,10.28 19.09,11.49 U2.6
N$1  (via drill 0.51)
  Top 0.254: U4.3 18.8,56.94 17.42,58.32 v17.42,59.12
  Bottom 0.305: v17.42,59.12 18.63,59.1 C9.1
N$2
  Bottom 0.406: R2.2 61.41,53.39 Q1.3
N$3
  Bottom 1.016: J4.1 57.88,16.65 D1.1 D1.2
N$6
  Bottom 0.254: U6.4 17.39,22.95 C11.1
N$7
  Bottom 0.406: R5.1 42.15,32.72 42.76,32.72 44.25,31.23 44.25,30.14 45.25,29.14 J1.3
N$8
  Bottom 0.406: R4.1 64.37,57.61 Q1.1 63.4,55.89 C6.1
N$9
  Bottom 0.254: C11.2 17.35,21.06 18.74,22.45 U6.3
N$10
  Bottom 0.254: U6.6 26.38,23.45 C12.1
N$11
  Bottom 0.254: U6.8 26.52,22.45 C12.2
NONE
  cutout Bottom: 15.88,47.61 17.85,47.61 17.89,47.57 17.89,45.66 15.88,45.66 15.84,45.7 15.84,47.61
  cutout Top: 15.76,47.66 15.79,47.63 17.91,47.63 17.91,45.78 17.92,45.77 15.75,45.77 15.71,45.73 15.71,47.58 15.76,47.63
RST  (via drill 0.51)
  Top 0.406: v37.31,56.79 37.31,37.25 v36.81,36.75
  Bottom 0.406: U1.29 36.83,56.31 v37.31,56.79 | v36.81,36.75 36.81,34.47 39.27,32.02 39.27,21.48 39.29,21.46 39.27,21.44 39.27,19.93 | 39.27,19.93 39.27,19.84 25.12,5.7 J2.5 | R1.1 40.52,19.93 39.27,19.93
SCK
  Top 0.406: U2.5 23.22,11.49 27.02,7.69 27.02,5.61 J2.3
  Bottom 0.406: U1.17 32.14,33.97 35.61,30.5 35.61,21.36 30.89,16.64 25.77,16.64 20.8,11.67 U2.5
SCL  (via drill 0.51)
  Top 0.254: v22.06,55.43 21.69,55.06 U4.27
  Top 0.305: U3.2 15.65,46.26 15.19,45.8 15.19,45.08 16,44.27 v21.82,44.27
  Top 0.406: v22.06,55.43 22.22,55.26 22.61,55.26 23.9,53.97 23.9,49.91 22.87,48.88 R8.2 21.74,47.7 21.74,44.35 v21.82,44.27
  Bottom 0.406: U1.28 36.03,56.19 35.12,57.1 32.68,57.1 31.65,56.07 22.7,56.07 v22.06,55.43 | U5.8 22,33.59 22,44.27 v21.82,44.27
SCL_BRD
  Bottom 0.406: U5.5 17.96,31.5 17.96,31.07 15.82,28.93 J5.4
SDA  (via drill 0.51)
  Top 0.254: U4.26 21.87,54.56 v22.25,54.18
  Top 0.305: U3.1 15.73,47.06 15.3,47.49 15.3,47.97 16.86,49.53 21.98,49.53 22.33,49.89 22.34,49.89 v22.73,50.28
  Top 0.406: v22.25,54.18 22.25,52.38 R7.2 22.94,50.49 v22.73,50.28
  Bottom 0.406: U1.27 35.23,56.09 34.83,56.49 32.93,56.49 31.9,55.46 23.34,55.46 22.97,55.09 22.97,55.05 22.25,54.33 v22.25,54.18 | v22.73,50.28 22.73,34.04 23.28,33.49 23.28,30.98 U5.1
SDA_BRD
  Bottom 0.406: J5.2 14.31,30.21 14.31,28.41 15.05,27.67 16.09,27.67 17.06,28.64 U5.4
TX_UART  (via drill 0.51)
  Top 0.406: v43.3,57.84 43.3,56.35 42.91,55.96 42.91,53.54 39.84,50.47 39.84,40.08 42.96,36.96 v42.96,36.75
  Bottom 0.406: U1.31 38.54,55.38 38.54,56.07 40.32,57.84 v43.3,57.84 | v42.96,36.75 44.55,35.16 46.4,35.16 48.07,33.49 48.07,25.31 40.88,18.12 40.88,11.88 35.76,6.76 J3.1
VCC  (via drill 0.51)
  Top 0.406: v55.84,57.39 54.22,55.77 54.22,54.95 | v59.54,51.5 56.85,51.5 v54.22,54.13 | v42.94,23.33 45.53,23.33 47.67,25.47 47.67,29.07 47.7,29.1 47.7,29.71 46.27,31.14 J1.2
  Top 1.016: 29.72,35.53 26.76,38.49 v26.76,48.72 26.76,55.18 31,59.42 49.75,59.42 54.22,54.95 v54.22,54.13 54.22,38.23 v51.52,35.53 | v51.52,35.53 29.72,35.53 | v51.52,35.53 51.52,16.62 CBAT.2 44.01,8.16 36.72,0.87 18.34,0.87 v17.17,2.04 17.17,5.32 U2.2 | v32.31,31.88 29.72,34.47 29.72,35.53 | v51.52,35.53 47.13,31.14 J1.2
  Bottom 0.406: U1.6 41.75,49.77 41.76,49.76 42.18,50.18 42.18,51.07 41.88,51.37 | U1.4 41.88,51.37 | U1.18 31.22,48.97 31.19,49 29.99,49 C4.1 | 41.88,51.37 42.59,51.37 C5.1 46.15,54.93 53.42,54.93 v54.22,54.13 | R4.2 56.08,57.63 v55.84,57.39 | Q1.2 62.85,51.5 v59.54,51.5 | R1.2 41.92,23.33 v42.94,23.33
  Bottom 1.016: C4.1 26.79,48.75 v26.76,48.72 | C5.1 43.61,52.3 | R9.1 15.53,3.68 v17.17,2.04 17.4,2.04 C7.1 | D1.3 56.92,30.13 v51.52,35.53 | Q2.2 32.31,31.72 v32.31,31.88
  pour Top: 26.27,60.01 81.75,60.01 81.86,59.9 81.86,0.65 81.81,0.6 13.8,0.6 13.75,0.65 13.75,19.5 34.87,19.5 34.92,19.55 35.24,19.87 35.24,29.46 33.62,29.46 26.21,36.87 26.21,59.91 26.3,60
VCC3V3
  Bottom 0.254: U6.5 18.86,23.45 18.22,24.09 C13.1
  Bottom 0.406: U5.7 20.3,34.62 C15.1
  Bottom 1.016: C15.1 20.47,35.16 15.67,35.16 13.03,32.52 J5.1 11.08,29.52 11.08,26.99 13.98,24.09 C13.1
VCC_EN  (via drill 0.51)
  Top 0.406: v35.49,42.76 31.15,38.42 v31.15,36.75
  Bottom 0.406: U1.10 38.43,45.72 35.49,42.78 v35.49,42.76 | v31.15,36.75 31.15,30.98 Q2.1
VCC_SENSORS  (via drill 0.51)
  Top 0.254: U4.1 19.8,56.62 20.29,57.11
  Top 0.305: 20.29,57.11 21.6,57.11 24.94,53.77 R7.1 | U3.3 18.55,46.26
  Top 0.406: 17.55,33.92 v17.53,33.95 | R7.1 24.94,57.3 v24.9,57.34 | 18.55,46.26 v18.62,46.19
  Top 1.016: R7.1 24.87,51.62 R8.1 24.66,48.62 v24.66,34.67 18.3,34.67 17.55,33.92 | v17.55,27.42 17.53,27.44 v17.53,33.95 15.32,36.16 v15.32,37.2
  Bottom 0.254: U6.7 24.42,22.97 28.73,22.97 C10.1
  Bottom 0.406: U5.3 19.64,27.52 C14.1 | U5.6 19.64,33.45 19.14,33.95 v17.53,33.95 | C16.1 24.34,57.9 v24.9,57.34 26.23,58.67 C17.1 | v15.32,37.2 15.32,37.25 20.37,42.3 C8.1 19.34,45.47 v18.62,46.19
  Bottom 1.016: v17.55,27.42 18.21,26.76 C14.1 | Q2.3 32.18,27.51 | Q2.3 32.02,27.51 24.87,34.67 v24.66,34.67 | Q2.3 33.19,26.32 30.01,23.14 C10.1
  pour Top: 13.78,59.99 25.56,59.99 25.56,36.62 33.39,28.79 34.63,28.79 34.63,20.15 26.27,20.15 26.29,20.17 26.29,25.67 26.38,25.76 17.45,25.76 17.35,25.66 17.35,34.93 17.44,35.02 13.79,35.02 13.76,35.05 13.76,59.89 13.68,59.97
XTAL1
  Bottom 0.406: U1.7 45.37,48.97 Y1.1 48.35,48.71 C1.1
XTAL2
  Bottom 0.406: U1.8 46.86,42.03 46.86,41.5 | Y1.2 46.73,41.37 46.86,41.5 | C2.1 47.72,42.36 46.86,41.5

### Text on the board
tPlace: v1.0